# Altium schematic sheet Negative Pwr.SchDoc
size A4
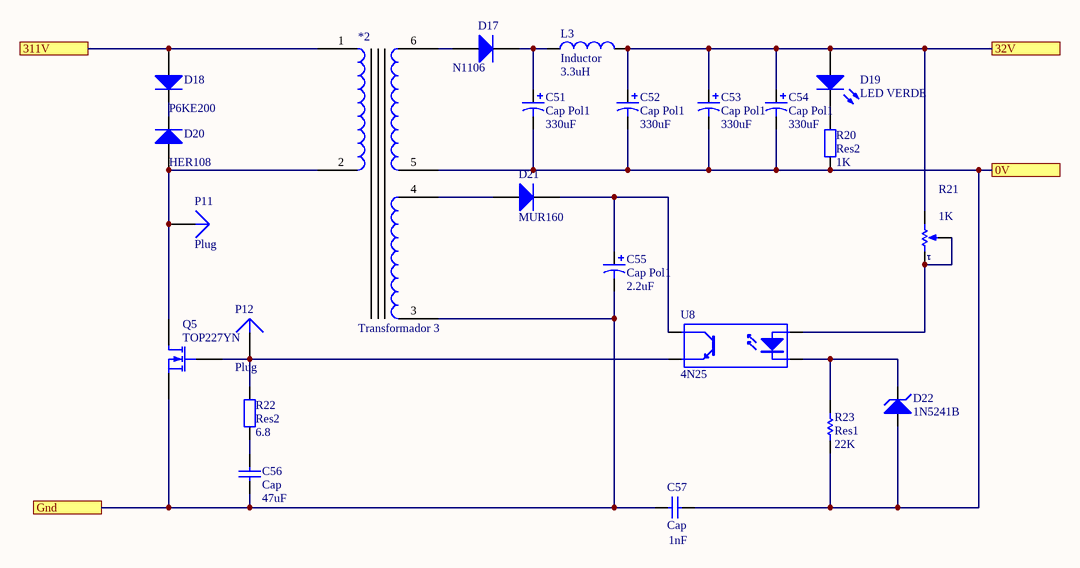
[diagram p0: Negative Pwr.SchDoc]

## Parts
*2  Transformador 3  [Transformador_flyback - duplicate]
C51  Cap Pol1  value 330uF  [CAPR D500 H1200 R200 mil]
C52  Cap Pol1  value 330uF  [CAPR D500 H1200 R200 mil]
C53  Cap Pol1  value 330uF  [CAPR D500 H1200 R200 mil]
C54  Cap Pol1  value 330uF  [CAPR D500 H1200 R200 mil]
C55  Cap Pol1  value 2.2uF  [CAPR D200 H450 R100 mil]
C56  Cap  value 47uF  [CAPR D250 H450 R100 mil]
C57  Cap  value 1nF  [RAD-0.2]
D17  N1106  [TO-220_A]
D18  P6KE200  [DO-15]
D19  LED VERDE  [Led 5mm ROJO]
D20  HER108  [DO-41]
D21  MUR160  [DO-41]
D22  VALOR: 1N5241B  [DO-41]  (hidden comment: Diodo Zener)
L3  Inductor  value 3.3uH  [Bobina 1.5*3]
P11  Plug  [PIN1]
P12  Plug  [PIN1]
Q5  TOP227YN  [TO-220AB]
R20  Res2  value 1K  [1206 resistor]
R21  VALOR: 1K  [Trimpot Horizontal]  (hidden comment: Trimpot)
R22  Res2  value 6.8  [1206 resistor]
R23  Res1  value 22K  [1206 resistor]
U8  4N25  [DIP-4]

## Ports
0V, 32V, 311V, Gnd

## Nets
0V: *2.5(L) C51.2 C52.2 C53.2 C54.2 C57.2 D22.1(A) R20.1 R23.1 ; port 0V
32V: C52.1 C53.1 C54.1 D19.1(A) L3.2 R21.2(BOT) ; port 32V
311V: *2.1(L) D18.1(A) ; port 311V
Gnd: *2.3(L) C55.2 C56.1 C57.1 Q5.2(S) ; port Gnd
Net*2_2: *2.2(L) D20.1(A) P11.1 Q5.3(D)
Net*2_4: *2.4(L) D21.1(A)
Net*2_6: *2.6(L) D17.3(A)
NetC51_1: C51.1 D17.1(K) L3.1
NetC55_1: C55.1 D21.2(K) U8.4(C)
NetC56_2: C56.2 R22.1
NetD18_2: D18.2(K) D20.2(K)
NetD19_2: D19.2(K) R20.2
NetD22_2: D22.2(K) R23.2 U8.2(K)
NetP12_1: P12.1 Q5.1(G) R22.2 U8.3(E)
NetR21_1: R21.1(TOP) R21.3(TAP) U8.1(A)

## Library data of the parts
C51-C55 = Cap Pol1: Polarized Capacitor (Radial); Published: 8-Jun-2000; LatestRevisionDate: 17-Jul-2002; LatestRevisionNote: Re-released for DXP Platform.; PackageReference: RB7.6-15; Publisher: Altium Limited; PackageDescription: Polarized Capacitor (Radial); 2 Leads
C56 C57 = Cap: Capacitor; Published: 8-Jun-2000; LatestRevisionDate: 17-Jul-2002; LatestRevisionNote: Re-released for DXP Platform.; PackageReference: RAD-0.3; Publisher: Altium Limited; PackageDescription: Radial Cap, Thru-Hole; 2 Leads; 0.3 in Pin Spacing
D17 D18 D20 D21 = Diode 1N4148: High Conductance Fast Diode; Published: 8-Jun-2000; LatestRevisionDate: 17-Jul-2002; LatestRevisionNote: Re-released for DXP Platform.; DatasheetVersion: 1997; PackageReference: DO-35; Publisher: Altium Limited; PackageDescription: Diode, Axial; Body 3.8 x 1.9 mm (LxDia. max), Lead Dia. 0.53 mm (max); Code_JEDEC: DO-204-AH; ComponentLink1Description: Manufacturer Link; ComponentLink1URL: http://www.fairchildsemi.com/; ComponentLink2Description: Datasheet; ComponentLink2URL: http://www.fairchildsemi.com/ds/1N%2F1N4148.pdf
D19 = LED0: Typical INFRARED GaAs LED; Published: 8-Jun-2000; LatestRevisionDate: 08-Jul-2005; LatestRevisionNote: Mech Layer 1 removed.; PackageReference: LED-0; Publisher: Altium Limited; PackageDescription: LED; 2 Leads
L3 = Inductor: Code_IEC: 1005; Published: 8-Jun-2000; LatestRevisionDate: 29-May-2009; LatestRevisionNote: IPC-7351 Footprint Added.; PackageReference: 0402-A; Publisher: Altium Limited; PackageDescription: Chip Inductor; Code_JEITA: 0402
Q5 = MOSFET-N: N-Channel MOSFET; Published: 8-Jun-2000; LatestRevisionDate: 17-Jul-2002; LatestRevisionNote: Re-released for DXP Platform.; PackageVersion: 1995/1996; PackageReference: E3; Publisher: Altium Limited; PackageDescription: TO, Flat Index; 3 In-Line, Axial Leads; Body Dia. 4.6mm; Lead Dia. 0.5 mm (max)
R20 R22 = Res2: Resistor; Published: 8-Jun-2000; LatestRevisionDate: 17-Jul-2002; LatestRevisionNote: Re-released for DXP Platform.; PackageReference: AXIAL-0.4; Publisher: Altium Limited; PackageDescription: Axial Device, Thru-Hole; 2 Leads; 0.4 in Pin Spacing
R21 = Trimpot: Preset; CODIGO STI: *; PROVEEDOR: *; FABRICANTE: *
R23 = Res1: Resistor; Published: 8-Jun-2000; LatestRevisionDate: 17-Jul-2002; LatestRevisionNote: Re-released for DXP Platform.; PackageReference: AXIAL-0.3; Publisher: Altium Limited; PackageDescription: Axial Device, Thru-Hole; 2 Leads; 0.3 in Pin Spacing
U8 = Optoisolator1: 4-Pin Phototransistor Optocoupler; Published: 24-Mar-1999; LatestRevisionDate: 04-Mar-2005; LatestRevisionNote: Sch pins 3 & 4 Swapped.; DatasheetVersion: Nov-2003; PackageReference: DIP-4; Publisher: Altium Limited
D22 = Diodo Zener: CODIGO STI: *; PROVEEDOR: *; FABRICANTE: *
P11 P12 = Plug: LatestRevisionDate: 17-Jul-2002; LatestRevisionNote: Re-released for DXP Platform.; Publisher: Altium Limited